# EAGLE schematic ElectronSheriff (EAGLE 9.5.2)
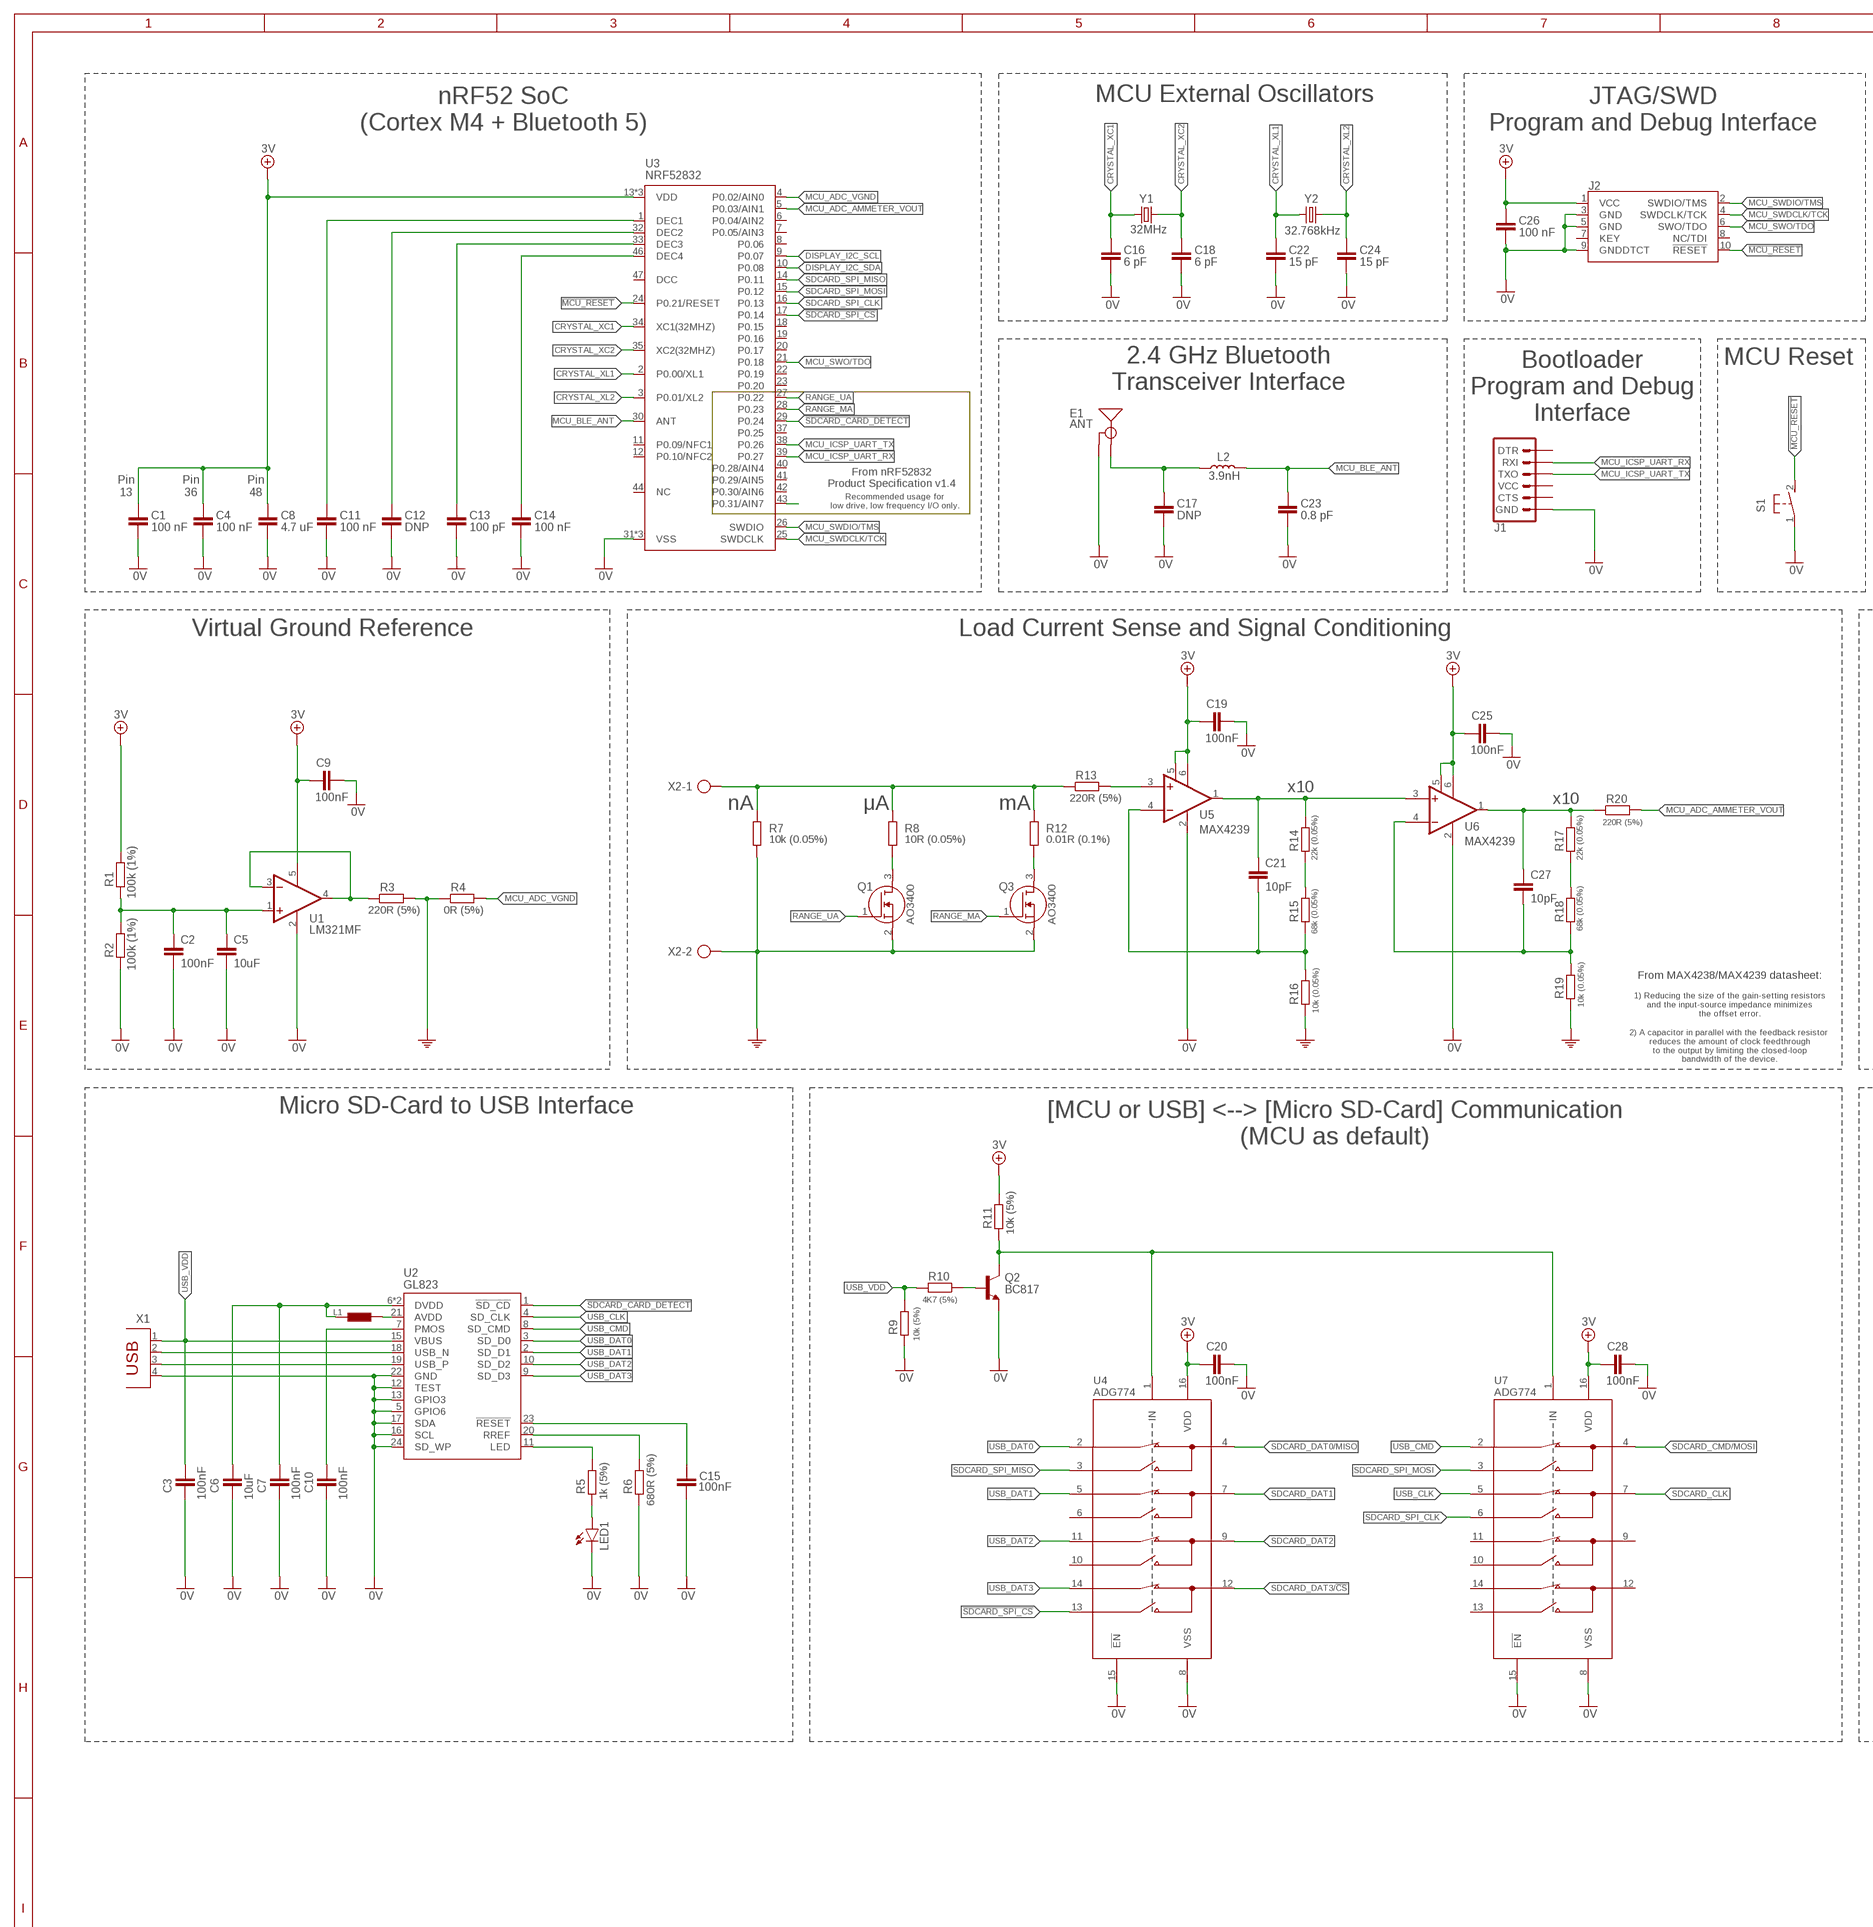
[diagram p0: schematic, sheet 1, part 1 of 2]
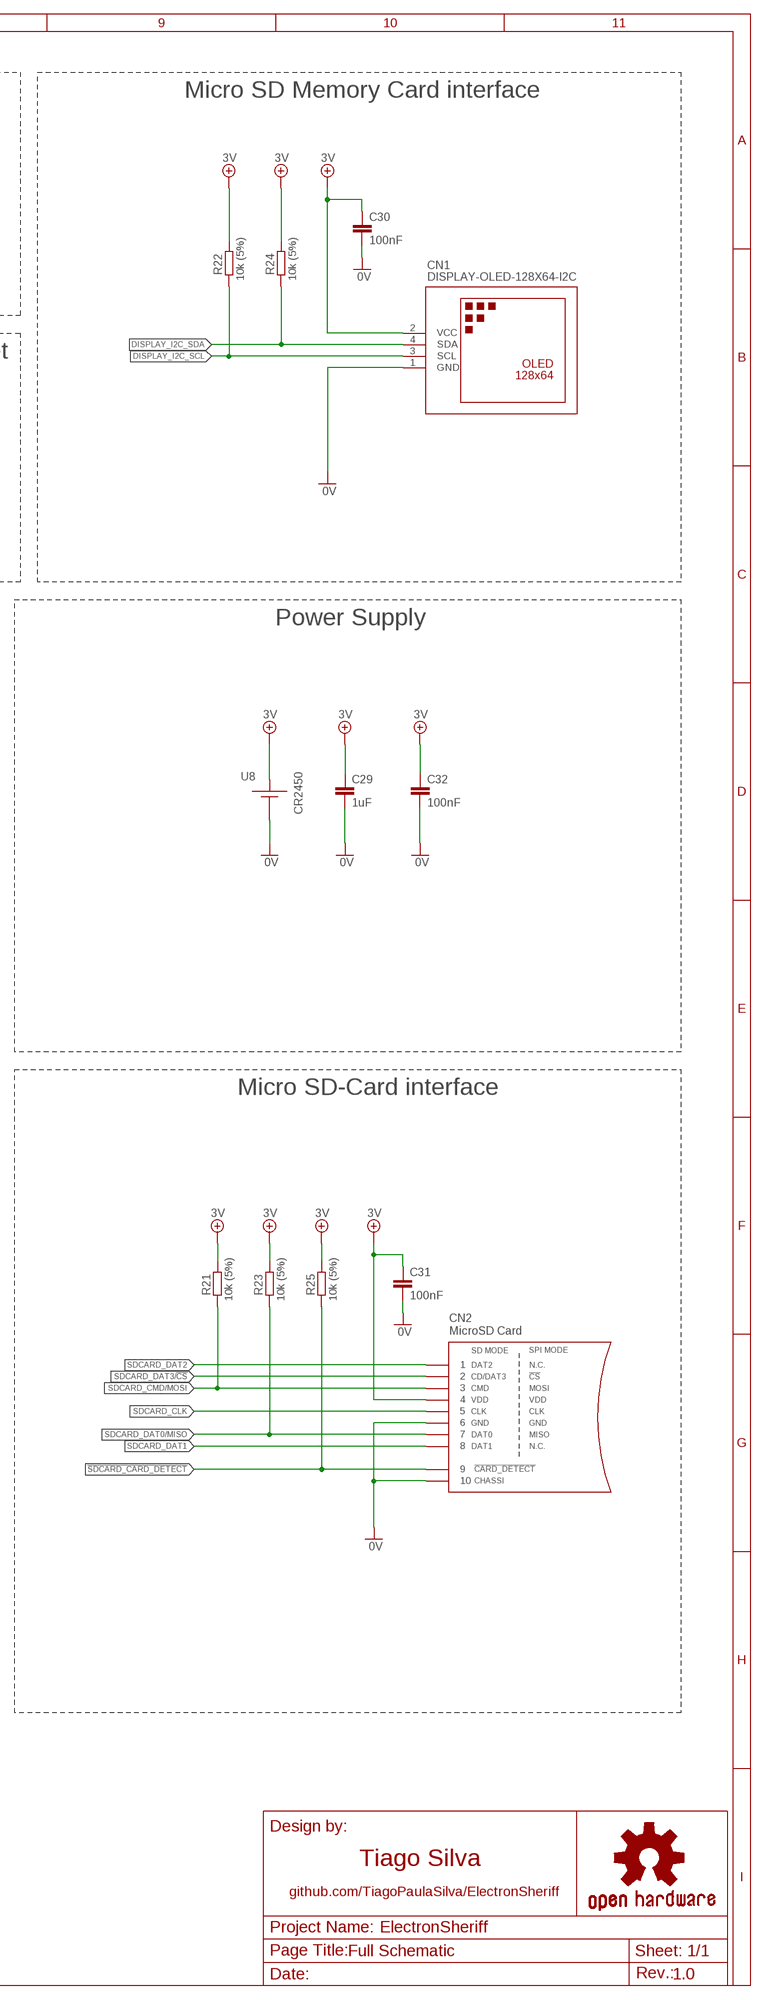
[diagram p1: schematic, sheet 1, part 2 of 2]

## Parts
C1  100 nF  C-EUC0603  [C0603]
C2  100nF  C-EUC0603  [C0603]
C3  100nF  C-EUC0603  [C0603]
C4  100 nF  C-EUC0603  [C0603]
C5  10uF  C-EUC0805  [C0805]
C6  10uF  C-EUC0603  [C0603]
C7  100nF  C-EUC0603  [C0603]
C8  4.7 uF  C-EUC0603  [C0603]
C9  100nF  C-EUC0603  [C0603]
C10  100nF  C-EUC0603  [C0603]
C11  100 nF  C-EUC0603  [C0603]
C12  DNP  C-EUC0603  [C0603]
C13  100 pF  C-EUC0603  [C0603]
C14  100 nF  C-EUC0603  [C0603]
C15  100nF  C-EUC0603  [C0603]
C16  6 pF  C-EUC0603  [C0603]
C17  DNP  C-EUC0603  [C0603]
C18  6 pF  C-EUC0603  [C0603]
C19  100nF  C-EUC0603  [C0603]
C20  100nF  C-EUC0603  [C0603]
C21  10pF  C-EUC0603  [C0603]
C22  15 pF  C-EUC0603  [C0603]
C23  0.8 pF  C-EUC0603  [C0603]
C24  15 pF  C-EUC0603  [C0603]
C25  100nF  C-EUC0603  [C0603]
C26  100 nF  C-EUC0603  [C0603]
C27  10pF  C-EUC0603  [C0603]
C28  100nF  C-EUC0603  [C0603]
C29  1uF  C-EUC0603  [C0603]
C30  100nF  C-EUC0603  [C0603]
C31  100nF  C-EUC0603  [C0603]
C32  100nF  C-EUC0603  [C0603]
CN1  DISPLAY-OLED-128X64-I2C  [DISPLAY-OLED-128X64-I2C]
CN2  MicroSD Card  MICROSD-PUSH-OUT  [MICROSD-PUSH-OUT]
E1  ANT  ANTENNA-GROUNDEDTRACE-15.2MM  [TRACE_ANTENNA_2.4GHZ_15.2MM]
J1  ARDUINO_SERIAL_PROGRAMPTH  [1X06]
J2  CORTEX_DEBUGPTH  [2X5-PTH-1.27MM]
L1  BLM15HB221SN1  [0402]
L2  3.9nH  INDUCTOR-0402-3.9NH  [0402]
LED1  LEDCHIPLED_0603  [CHIPLED_0603]
Q1  AO3400  [SOT95P280X125-3N]
Q2  BC817  BC817-16LT1SMD  [SOT23-BEC]
Q3  AO3400  [SOT95P280X125-3N]
R1  100k (1%)  R-EU_R0603  [R0603]
R2  100k (1%)  R-EU_R0603  [R0603]
R3  220R (5%)  R-EU_R0603  [R0603]
R4  0R (5%)  R-EU_R0603  [R0603]
R5  1k (5%)  R-EU_R0603  [R0603]
R6  680R (5%)  R-EU_R0603  [R0603]
R7  10k (0.05%)  R-EU_R0603  [R0603]
R8  10R (0.05%)  R-EU_R0603  [R0603]
R9  10k (5%)  R-EU_R0603  [R0603]
R10  4K7 (5%)  R-EU_R0603  [R0603]
R11  10k (5%)  R-EU_R0603  [R0603]
R12  0.01R (0.1%)  R-EU_R0603  [R0603]
R13  220R (5%)  R-EU_R0603  [R0603]
R14  22k (0.05%)  R-EU_R0603  [R0603]
R15  68k (0.05%)  R-EU_R0603  [R0603]
R16  10k (0.05%)  R-EU_R0603  [R0603]
R17  22k (0.05%)  R-EU_R0603  [R0603]
R18  68k (0.05%)  R-EU_R0603  [R0603]
R19  10k (0.05%)  R-EU_R0603  [R0603]
R20  220R (5%)  R-EU_R0603  [R0603]
R21  10k (5%)  R-EU_R0603  [R0603]
R22  10k (5%)  R-EU_R0603  [R0603]
R23  10k (5%)  R-EU_R0603  [R0603]
R24  10k (5%)  R-EU_R0603  [R0603]
R25  10k (5%)  R-EU_R0603  [R0603]
S1  DTSM-3  [DTSM-3]
U1  LM321MF  [SOT23-5]
U2  GL823  GL823(B)HG  [SSOP24]
U3  NRF52832  [QFN48-6X6MM]
U4  ADG774  [SOIC127P600X175-16N]
U5  MAX4239  MAX4239AUTT  [SOT95P280X145-6N]
U6  MAX4239  MAX4239AUTT  [SOT95P280X145-6N]
U7  ADG774  [SOIC127P600X175-16N]
U8  CR2450  1053  [1053]
X1  PN87520  [PN87520]
X2  AK500/2-H  [AK500/2-H]
Y1  32MHz  CRYSTAL-32MHZ-SMD-2.0X1.6MM  [CRYSTAL-SMD-2.0X1.6MM]
Y2  32.768kHz  CRYSTAL-32.768KHZSMD-3.2X1.5  [CRYSTAL-SMD-3.2X1.5MM]

## Nets
0V: C1.2 C2.2 C3.1 C4.2 C5.2 C6.1 C7.1 C8.2 C9.2 C10.1 C11.2 C12.2 C13.2 C14.2 C15.1 C16.2 C17.2 C18.2 C19.2 C20.2 C22.2 C23.2 C24.2 C25.2 C26.2 C28.2 C29.2 C30.2 C31.2 C32.2 CN1.1(GND) CN2.6 CN2.G1 CN2.G2 CN2.G3 CN2.G4 E1.GND J1.6(GND) J2.3(GND) J2.5(GND) J2.9(GNDDTCT) LED1.C Q2.E R2.1 R6.2 R9.2 S1.1 U1.2(V-) U2.5(GPIO6) U2.12(TEST) U2.13(GPIO3) U2.16(SCL) U2.17(SDA) U2.22(GND) U2.24(SD_WP) U3.31(VSS) U3.45(VSS) U3.EP(VSS) U4.8(VSS) U4.15(!EN!) U5.2(GND) U6.2(GND) U7.8(VSS) U7.15(!EN!) U8.1(GND) X1.4
!MCU_RESET!: J2.10(!RESET) S1.2 U3.24(P0.21/RESET)
!SDCARD_CARD_DETECT!: CN2.9 R25.1 U2.1(!SD_CD) U3.29(P0.24)
!SDCARD_SPI_CS!: U3.17(P0.14) U4.13(S4B)
+5V: C1.1 C4.1 C8.1 C9.1 C19.1 C20.1 C25.1 C26.1 C28.1 C29.1 C30.1 C31.1 C32.1 CN1.2(VCC) CN2.4 J2.1(VCC) R1.2 R11.2 R21.2 R22.2 R23.2 R24.2 R25.2 U1.5(V+) U3.13(VDD) U3.36(VDD) U3.48(VDD) U4.16(VDD) U5.5(!SHDN) U5.6(VCC) U6.5(!SHDN) U6.6(VCC) U7.16(VDD) U8.2(3V) ; supply symbol labelled 3V
ADC_AMMETER: C21.1 R14.2 U5.1(OUT) U6.3(IN+)
ADC_AMMETER1: C27.1 R17.2 R20.1 U6.1(OUT)
CRYSTAL_XC1: C16.1 U3.34(XC1(32MHZ)) Y1.3
CRYSTAL_XC2: C18.1 U3.35(XC2(32MHZ)) Y1.1
CRYSTAL_XL1: C22.1 U3.2(P0.00/XL1) Y2.P$2
CRYSTAL_XL2: C24.1 U3.3(P0.01/XL2) Y2.P$1
DISPLAY_I2C_SCL: CN1.3(SCL) R22.1 U3.9(P0.07)
DISPLAY_I2C_SDA: CN1.4(SDA) R24.1 U3.10(P0.08)
MCU_ADC_AMMETER_VOUT: R20.2 U3.5(P0.03/AIN1)
MCU_ADC_VGND: R4.2 U3.4(P0.02/AIN0)
MCU_BLE_ANT: C23.1 L2.2 U3.30(ANT)
MCU_ICSP_UART_RX: J1.2(RXI) U3.39(P0.27)
MCU_ICSP_UART_TX: J1.3(TXO) U3.38(P0.26)
MCU_SWDCLK/TCK: J2.4(SWDCLK/TCK) U3.25(SWDCLK)
MCU_SWDIO/TMS: J2.2(SWDIO/TMS) U3.26(SWDIO)
MCU_SWO/TDO: J2.6(SWO/TDO) U3.21(P0.18)
MUX_MCU2USB: Q2.C R11.1 U4.1(IN) U7.1(IN)
N$1: C6.2 C7.2 L1.1 U2.6(DVDD) U2.14(DVDD)
N$2: C2.1 C5.1 R1.1 R2.2 U1.1(+IN)
N$3: R14.1 R15.2
N$4: R3.1 U1.3(-IN) U1.4(OUT)
N$5: C21.2 R15.1 R16.2 U5.4(IN-)
N$6: R13.2 U5.3(IN+)
N$7: R7.2 R8.2 R12.2 R13.1 X2.1
N$8: C11.1 U3.1(DEC1)
N$9: Q1.3(D) R8.1
N$10: Q3.3(D) R12.1
N$11: C17.1 E1.ANT(SIGNAL) L2.1
N$12: C12.1 U3.32(DEC2)
N$13: C13.1 U3.33(DEC3)
N$14: Q2.B R10.1
N$15: C14.1 U3.46(DEC4)
N$16: C10.2 U2.7(PMOS)
N$17: C15.2 U2.23(!RESET)
N$18: R6.1 U2.20(RREF)
N$19: L1.2 U2.21(AVDD)
N$20: R17.1 R18.2
N$21: U2.18(USB_N) X1.2
N$22: U2.19(USB_P) X1.3
N$23: R5.1 U2.11(LED)
N$24: LED1.A R5.2
N$25: C27.2 R18.1 R19.2 U6.4(IN-)
P31: U3.43(P0.31/AIN7)
RANGE_MA: Q3.1(G) U3.28(P0.23)
RANGE_UA: Q1.1(G) U3.27(P0.22)
SDCARD_CLK: CN2.5 U7.7(D2)
SDCARD_CMD/MOSI: CN2.3 R21.1 U7.4(D1)
SDCARD_DAT0/MISO: CN2.7 R23.1 U4.4(D1)
SDCARD_DAT1: CN2.8 U4.7(D2)
SDCARD_DAT2: CN2.1 U4.9(D3)
SDCARD_DAT3/!CS!: CN2.2 U4.12(D4)
SDCARD_SPI_CLK: U3.16(P0.13) U7.6(S2B)
SDCARD_SPI_MISO: U3.14(P0.11) U4.3(S1B)
SDCARD_SPI_MOSI: U3.15(P0.12) U7.3(S1B)
USB_CLK: U2.4(SD_CLK) U7.5(S2A)
USB_CMD: U2.8(SD_CMD) U7.2(S1A)
USB_DAT0: U2.3(SD_D0) U4.2(S1A)
USB_DAT1: U2.2(SD_D1) U4.5(S2A)
USB_DAT2: U2.10(SD_D2) U4.11(S3A)
USB_DAT3: U2.9(SD_D3) U4.14(S4A)
USB_VDD: C3.2 R9.1 R10.2 U2.15(VBUS) X1.1
VGND: Q1.2(S) Q3.2(S) R3.2 R4.1 R7.1 R16.1 R19.1 X2.2
Unconnected: J1.1(DTR) J1.4(VCC) J1.5(CTS) J2.7(KEY) J2.8(NC/TDI) U3.6(P0.04/AIN2) U3.7(P0.05/AIN3) U3.8(P0.06) U3.11(P0.09/NFC1) U3.12(P0.10/NFC2) U3.18(P0.15) U3.19(P0.16) U3.20(P0.17) U3.22(P0.19) U3.23(P0.20) U3.37(P0.25) U3.40(P0.28/AIN4) U3.41(P0.29/AIN5) U3.42(P0.30/AIN6) U3.44(NC) U3.47(DCC) U4.6(S2B) U4.10(S3B) U7.9(D3) U7.10(S3B) U7.11(S3A) U7.12(D4) U7.13(S4B) U7.14(S4A)

## Notes on the sheet
- MCU External Oscillators | Micro SD Memory Card interface
- nRF52 SoC
  (Cortex M4 + Bluetooth 5)
- JTAG/SWD
  Program and Debug Interface
- MCU Reset
- 2.4 GHz Bluetooth
  Transceiver Interface
- Bootloader
  Program and Debug
  Interface
- From nRF52832
  Product Specification v1.4
- Pin
  13
- Pin
  36
- Pin
  48
- Recommended usage for
  low drive, low frequency I/O only.
- Virtual Ground Reference | Load Current Sense and Signal Conditioning | Power Supply
- x10
- x10
- nA | μA | mA
- From MAX4238/MAX4239 datasheet:
- 1) Reducing the size of the gain-setting resistors
  and the input-source impedance minimizes
  the offset error.
- 2) A capacitor in parallel with the feedback resistor 
  reduces the amount of clock feedthrough
  to the output by limiting the closed-loop
  bandwidth of the device.
- Micro SD-Card to USB Interface | Micro SD-Card interface
- [MCU or USB] <--> [Micro SD-Card] Communication
  (MCU as default)
- POWER SUPPLY
- Tiago Silva
- github.com/TiagoPaulaSilva/ElectronSheriff
- Full Schematic
- 1.0

## Library data of the parts
C1-C32 = rcl:C-EU: CAPACITOR, European symbol; SPICEPREFIX: C
CN1 = diy-modules:DISPLAY-OLED-128X64-I2C: 128x64 Dot Matrix OLED Module based on SSD1306 chip Variant with I2C interface More details available here: http://www.instructables.com/id/Monochrome-096-i2c-OLED-display-with-arduino-SSD13/ SSD1306 datasheet: https://cdn-shop.adafruit.com/datasheets/SSD1306.pdf Click here to find device on ebay.com <http://www.ebay.com/sch/oled+display+128x64+iic> Note: There are two variants: I2C and SPI. Search for the proper version.
CN2 = Micro SD:MICROSD-PUSH-OUT: T-Flash Push-Out Micro SD Card Reader 14.75mm x 14.5mm SMD with external pins
E1 = SparkFun-RF:ANTENNA-GROUNDED: Antenna w/ Ground Connection 2.4GHz antennae with signal and ground terminals. TRACE_ANTENNA_2.4GHZ_15.2MM - Meander Trace antenna 15.2 x 5.7mm footprint Based on layout from TI app note AN043 <http://www.ti.com/lit/an/swra117d/swra117d.pdf>. TRACE_ANTENNA_2.4GHZ_25.7MM - Inverted F trace antenna 25.7 x 7.5 mm footprint. Based on layout from TI design note DN0007 <http://www.ti.com/lit/an/swru120b/swru120b.pdf>.
J1 = SparkFun-Connectors:ARDUINO_SERIAL_PROGRAM: FTDI connector footprints
J2 = SparkFun-Connectors:CORTEX_DEBUG: Cortex Debug Connector Datasheet <http://infocenter.arm.com/help/topic/com.arm.doc.faqs/attached/13634/cortex_debug_connectors.pdf>
L1 = inductors:BLM15H: EMIFIL (R) Chip Ferrite Bead for GHz Noise Source: http://www.murata.com/ Ferrite Bead BLM15H.pdf
L2 = nrf52832-breakout-temp:INDUCTOR: Inductors Resist changes in electrical current. Basically a coil of wire. SparkFun Products: SparkFun Load Cell Amplifier - HX711 <https://www.sparkfun.com/products/13879> IOIO-OTG - V2.2 <https://www.sparkfun.com/products/13613>; PROD_ID: NDUC-13457
LED1 = led:LED: LED OSRAM: - CHIPLED LG R971, LG N971, LY N971, LG Q971, LY Q971, LO R971, LY R971 LH N974, LH R974 LS Q976, LO Q976, LY Q976 LO Q996 - Hyper CHIPLED LW Q18S LB Q993, LB Q99A, LB R99A - SideLED LS A670, LO A670, LY A670, LG A670, LP A670 LB A673, LV A673, LT A673, LW A673 LH A674 LY A675 LS A676, LA A676, LO A676, LY A676, LW A676 LS A679, LY A679, LG A679 - Hyper Micro SIDELED® LS Y876, LA Y876, LO Y876, LY Y876 LT Y87S - SmartLED LW L88C, LW L88S LB L89C, LB L89S, LG L890 LS L89K, LO L89K, LY L89K LS L896, LA L896, LO L896, LY L896 - TOPLED LS T670, LO T670, LY T670, LG T670, LP T670 LSG T670, LSP T670, LSY T670, LOP T670, LYG T670 LG T671, LOG T671, LSG T671 LB T673, LV T673, LT T673, LW T673 LH T674 LS T676, LA T676, LO T676, LY T676, LB T676, LH T676, LSB T676, LW T676 LB T67C, LV T67C, LT T67C, LS T67K, LO T67K, LY T67K, LW E67C LS E67B, LA E67B, LO E67B, LY E67B, LB E67C, LV E67C, LT E67C LW T67C LS T679, LY T679, LG T679 LS T770, LO T770, LY T770, LG T770, LP T770 LB T773, LV T773, LT T773, LW T773 LH T774 LS E675, LA E675, LY E675, LS T675 LS T776, LA T776, LO T776, LY T776, LB T776 LHGB T686 LT T68C, LB T68C - Hyper Mini TOPLED® LB M676 - Mini TOPLED Santana® LG M470 LS M47K, LO M47K, LY M47K Source: http://www.osram.convergy.de LUXEON: - LUMILED® LXK2-PW12-R00, LXK2-PW12-S00, LXK2-PW14-U00, LXK2-PW14-V00 LXK2-PM12-R00, LXK2-PM12-S00, LXK2-PM14-U00 LXK2-PE12-Q00, LXK2-PE12-R00, LXK2-PE12-S00, LXK2-PE14-T00, LXK2-PE14-U00 LXK2-PB12-K00, LXK2-PB12-L00, LXK2-PB12-M00, LXK2-PB14-N00, LXK2-PB14-P00, LXK2-PB14-Q00 LXK2-PR12-L00, LXK2-PR12-M00, LXK2-PR14-Q00, LXK2-PR14-R00 LXK2-PD12-Q00, LXK2-PD12-R00, LXK2-PD12-S00 LXK2-PH12-R00, LXK2-PH12-S00 LXK2-PL12-P00, LXK2-PL12-Q00, LXK2-PL12-R00 Source: www.luxeon.com KINGBRIGHT: KA-3528ASYC Source: www.kingbright.com
Q1 Q3 = AO3400:AO3400: 30V N-Channel MOSFET Source: Datasheet <http://aosmd.com/res/data_sheets/AO3400.pdf>; DESCRIPTION: 30V N-Channel MOSFET; HEIGHT: 1.25mm; MANUFACTURER_NAME: Alpha & Omega Semiconductors; MANUFACTURER_PART_NUMBER: AO3400
Q2 = transistor-npn:BC817*: NPN Transistor
R1-R25 = rcl:R-EU_: RESISTOR, European symbol; SPICEPREFIX: R
S1 = switch-tact:DTSM-3
U1 = linear:LM321?*: Low Power Single Op Amp Source: http://cache.national.com/ds/LM/LM321.pdf
U2 = GL823:GL823(B): USB 2.0 SD/MMC Card Reader Controller (5V)
U3 = nrf52832-breakout-temp:NRF52832: Nordic nRF52832 Bluetooth Smart/ANT/2.4GHz RF SoC The nRF52832 SoC is a powerful, highly flexible ultra-low power multiprotocol SoC ideally suited for Bluetooth® Smart ANT and 2.4GHz ultra low-power wireless applications. The nRF52832 SoC is built around a 32-bit ARM® Cortex™-M4F CPU with 512kB + 64kB RAM. The embedded 2.4GHz transceiver supports Bluetooth Smart, ANT and proprietary 2.4 GHz protocol stack. It is on air compatible with the nRF51 Series, nRF24L and nRF24AP Series products from Nordic Semiconductor. Product Page <https://www.nordicsemi.com/eng/Products/Bluetooth-low-energy2/nRF52832>; PROD_ID: IC-13460
U4 U7 = ADG774:ADG774
U5 U6 = MAX4239AUT+:MAX4239AUTT; AVAILABILITY: Unavailable; DESCRIPTION: General Purpose Amplifier 1 Circuit Rail-to-Rail SOT-23-6; MF: Maxim Integrated; MP: MAX4239AUT+T; PACKAGE: SOT-23-6 Maxim; PRICE: None
U8 = 1053:1053: Coin Cell Battery Holders BATTERY HOLDER FOR CR2450 Source: Datasheet <https://componentsearchengine.com/Datasheets/1/1053.pdf>; DESCRIPTION: Coin Cell Battery Holders BATTERY HOLDER FOR CR2450; HEIGHT: mm; MANUFACTURER_NAME: Keystone Electronics; MANUFACTURER_PART_NUMBER: 1053; MOUSER_PART_NUMBER: 534-1053-BH; MOUSER_PRICE-STOCK: https://www.mouser.com/Search/Refine.aspx?Keyword=534-1053-BH
X1 = con-berg:PN87520: BERG USB connector; OC_FARNELL: unknown; OC_NEWARK: unknown
X2 = con-ptr500:AK500/2-H: CONNECTOR Aug. 2004 / PTR Meßtechnik: Die Bezeichnung der Serie AK505 wurde geändert. Es handelt sich hierbei um AK500 in horizontaler Ausführung.; OC_FARNELL: unknown; OC_NEWARK: unknown
Y1 = nrf52832-breakout-temp:CRYSTAL-32MHZ: 32MHz Crystal Digikey Example <http://www.digikey.com/product-detail/en/murata-electronics-north-america/XRCGB32M000F2P00R0/490-9769-1-ND/4952013> Frequency: 32MHz Frequency Stability: ±20ppm Frequency Tolerance: ±20ppm Load Capacitance: 6pF; PROD_ID: XTAL-13459
Y2 = SparkFun-Clocks:CRYSTAL-32.768KHZ: 32.768kHz Crystal Frequency: 32.768kHz Frequency Stability: ±20ppm Load Capacitance: 12.5pF (PTH-2X6 & SMD-3.2X1.5), 6pF (SMD-2X6); PROD_ID: XTAL-13062

## Net classes
2 gnd: width 0.152 mm, drill 0.559 mm, clearance 0.254 mm